# Altium project MSB.PrjPcb
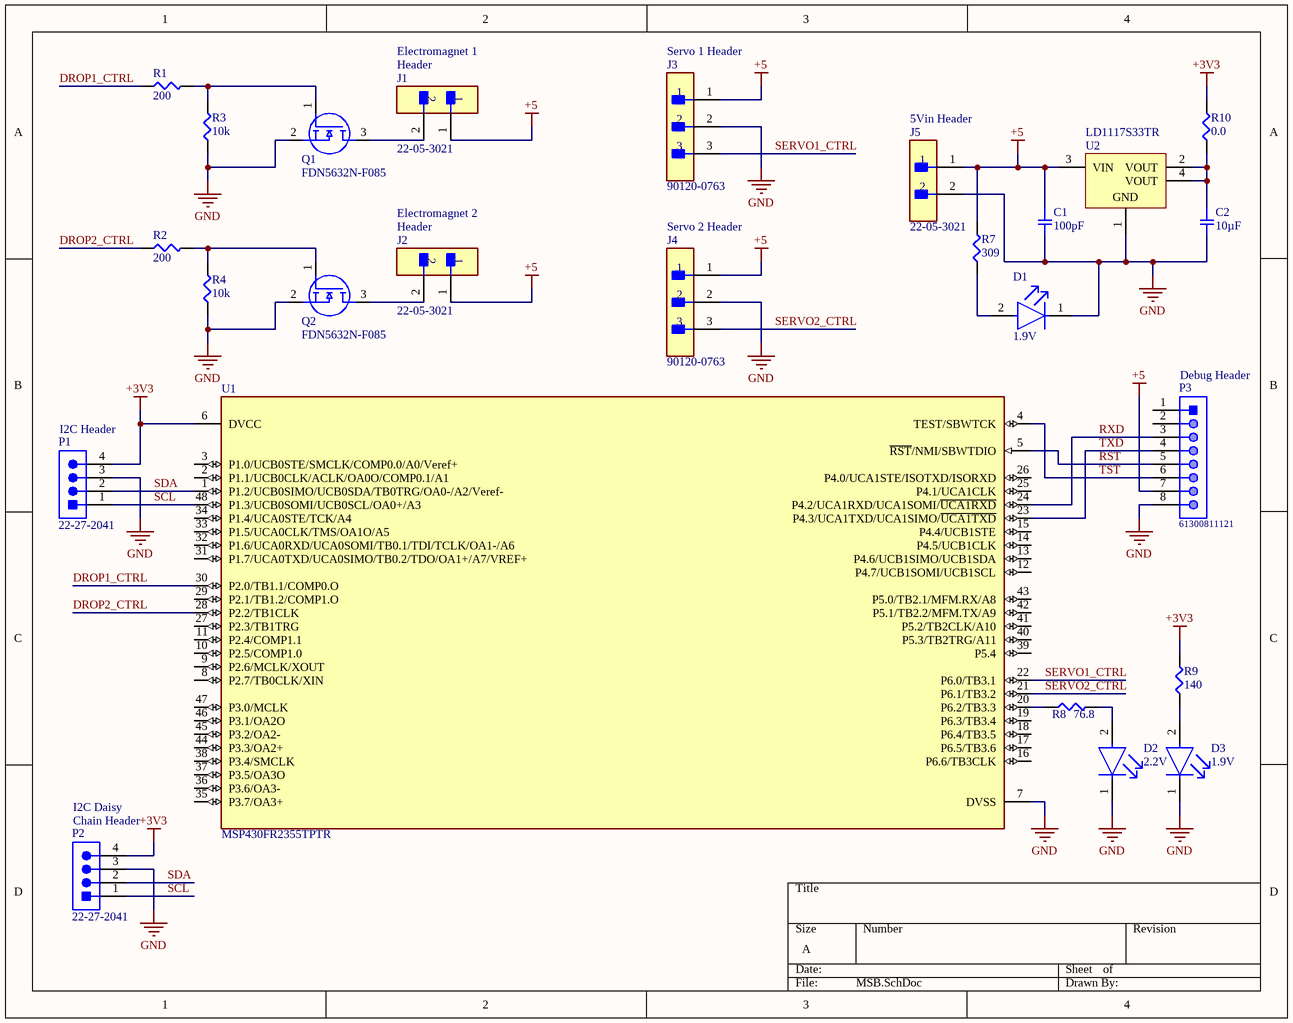
[diagram p0: MSB.SchDoc]
1 sheet, 25 parts. Net scope: global (net labels, ports and power ports of the same name join across sheets).
Board file: MSB.PcbDoc

## Sheet MSB.SchDoc
size A

### Parts
C1  100pF  [SMD-0805C]
C2  10µF  [SMD-0805C]
D1  1.9V  [FP-150080SS75000-MFG]
D2  2.2V  [FP-LTST-C171GKT-MFG]
D3  1.9V  [FP-150080SS75000-MFG]
J1  22-05-3021  [FP-22-05-3021-MFG]
J2  22-05-3021  [FP-22-05-3021-MFG]
J3  90120-0763  [FP-90120-0763-MFG]
J4  90120-0763  [FP-90120-0763-MFG]
J5  22-05-3021  [FP-22-05-3021-MFG]
P1  22-27-2041  [MOLX-22-27-2041_V]
P2  22-27-2041  [MOLX-22-27-2041_V]
P3  61300811121  [61300811121]
Q1  FDN5632N-F085  [SOT95P237X122-3N]
Q2  FDN5632N-F085  [SOT95P237X122-3N]
R1  200  [SMD-0805-RES]
R2  200  [SMD-0805-RES]
R3  10k  [SMD-0805-RES]
R4  10k  [SMD-0805-RES]
R7  309  [SMD-0805-RES]
R8  76.8  [SMD-0805-RES]
R9  140  [SMD-0805-RES]
R10  0.0  [SMD-0805-RES]
U1  MSP430FR2355TPTR  [FP-PT0048A-MFG]
U2  LD1117S33TR  [SOT-223_L]

### Nets
+3V3: P1.4 P2.4 R9.2 R10.2 U1.6(DVCC)
+5: C1.1 J1.1 J2.1 J3.1 J4.1 J5.1 P3.7 R7.2 U2.3(VIN)
GND: C1.2 C2.2 D1.1(C) D2.1(C) D3.1(C) J3.2 J4.2 J5.2 P1.3 P2.3 P3.8 Q1.2(S) Q2.2(S) R3.1 R4.1 U1.7(DVSS) U2.1(GND)
DROP1_CTRL: R1.1 U1.30(P2.0/TB1.1/COMP0.O)
DROP2_CTRL: R2.1 U1.28(P2.2/TB1CLK)
RST: P3.5 U1.5(~{RST}/NMI/SBWTDIO)
RXD: P3.3 U1.24(P4.2/UCA1RXD/UCA1SOMI/~{UCA1RXD})
SCL: P1.1 P2.1 U1.48(P1.3/UCB0SOMI/UCB0SCL/OA0+/A3)
SDA: P1.2 P2.2 U1.1(P1.2/UCB0SIMO/UCB0SDA/TB0TRG/OA0-/A2/Veref-)
SERVO1_CTRL: J3.3 U1.22(P6.0/TB3.1)
SERVO2_CTRL: J4.3 U1.21(P6.1/TB3.2)
TST: P3.6 U1.4(TEST/SBWTCK)
TXD: P3.4 U1.23(P4.3/UCA1TXD/UCA1SIMO/~{UCA1TXD})
NetC2_1: C2.1 R10.1 U2.2(VOUT) U2.4(VOUT)
NetD1_2: D1.2(A) R7.1
NetD2_2: D2.2(A) R8.2
NetD3_2: D3.2(A) R9.1
NetJ1_2: J1.2 Q1.3(D)
NetJ2_2: J2.2 Q2.3(D)
NetQ1_1: Q1.1(G) R1.2 R3.2
NetQ2_1: Q2.1(G) R2.2 R4.2
NetR8_1: R8.1 U1.20(P6.2/TB3.3)

Not connected (* = marked no-connect by the designer): P3 1 2; U1 2(P1.1/UCB0CLK/ACLK/OA0O/COMP0.1/A1) 3(P1.0/UCB0STE/SMCLK/COMP0.0/A0/Veref+) 8(P2.7/TB0CLK/XIN) 9(P2.6/MCLK/XOUT) 10(P2.5/COMP1.0) 11(P2.4/COMP1.1) 12(P4.7/UCB1SOMI/UCB1SCL) 13(P4.6/UCB1SIMO/UCB1SDA) 14(P4.5/UCB1CLK) 15(P4.4/UCB1STE) 16(P6.6/TB3CLK) 17(P6.5/TB3.6) 18(P6.4/TB3.5) 19(P6.3/TB3.4) 25(P4.1/UCA1CLK) 26(P4.0/UCA1STE/ISOTXD/ISORXD) 27(P2.3/TB1TRG) 29(P2.1/TB1.2/COMP1.O) 31(P1.7/UCA0TXD/UCA0SIMO/TB0.2/TDO/OA1+/A7/VREF+) 32(P1.6/UCA0RXD/UCA0SOMI/TB0.1/TDI/TCLK/OA1-/A6) 33(P1.5/UCA0CLK/TMS/OA1O/A5) 34(P1.4/UCA0STE/TCK/A4) 35(P3.7/OA3+) 36(P3.6/OA3-) 37(P3.5/OA3O) 38(P3.4/SMCLK) 39(P5.4) 40(P5.3/TB2TRG/A11) 41(P5.2/TB2CLK/A10) 42(P5.1/TB2.2/MFM.TX/A9) 43(P5.0/TB2.1/MFM.RX/A8) 44(P3.3/OA2+) 45(P3.2/OA2-) 46(P3.1/OA2O) 47(P3.0/MCLK)

### Notes on the sheet
- Header
- Electromagnet 1
- (near J3) Servo 1 Header
- (near J5) 5Vin Header
- Electromagnet 2
- (near J4) Servo 2 Header
- (near P1) I2C Header
- (near P3) Debug Header
- (near P2) Chain Header
- (near P2) I2C Daisy

### Library data of the parts
C1 = GQM2195C1H101JB01D: CAP CER 100PF 50V NP0 0805; Manufacturer: Murata Electronics North America; Unit Price (USD): 1.22; Tolerance: ±5%; Quantity Available: 5437; Packaging: Cut Tape (CT); Value: 100pF; Operating Temperature: -55°C ~ 125°C; Package / Case: 0805 (2012 Metric); Manufacturer Part Number: GQM2195C1H101JB01D; Mount: Surface Mount, MLCC; Datasheet URL: http://www.murata.com/~/media/webrenewal/support/library/catalog/products/capacitor/mlcc/c02e.pdf
C2 = GCJ21BR71A106KE01L: CAP CER 10UF 10V X7R 0805; Manufacturer: Murata Electronics North America; Unit Price (USD): 0.56; Tolerance: ±10%; Quantity Available: 2702; Packaging: Cut Tape (CT); Value: 10µF; Operating Temperature: -55°C ~ 125°C; Package / Case: 0805 (2012 Metric); Manufacturer Part Number: GCJ21BR71A106KE01L; Mount: Surface Mount, MLCC; Datasheet URL: http://www.murata.com/~/media/webrenewal/support/library/catalog/products/capacitor/mlcc/c03e.ashx
D1 D3 = CMP-1426-00010-2: LED RED CLEAR 0805 SMD, 150080SS75000; Manufacturer: Wurth Elektronik; Luminous Intensity: 60mcd; Packaging: Cut Tape; Forward Voltage: 1.9V; Mount: Surface Mount; Color: Red; Value: 1.9V; Manufacturer Part Number: 150080SS75000
D2 = CMP-22017-000007-1: LED GREEN CLEAR CHIP SMD, LTST-C171GKT; Manufacturer: Vishay; Luminous Intensity: 12mcd; Forward Voltage: 2.1V; Value: 2.1V; Mount: Surface Mount; Packaging: Tape and Reel; Color: Green; Manufacturer Part Number: LTST-C171GKT
J1 J2 J5 = CMP-04776-000166-1: CONN HEADER R/A 2POS 2.54MM; Manufacturer: Molex; Color: White; Mount: Through Hole; Packaging: Bulk; Pitch: 2.54mm; Orientation: Right Angle; Manufacturer Part Number: 22-05-3021
J3 J4 = CMP-04776-000084-1: CONN HEADER VERT 3POS 2.54MM; Manufacturer: Molex; Manufacturer Part Number: 90120-0763; Pitch: 2.54mm; Mount: Board-To-Board Connector, C-Grid III 90120 Series, Through Hole, Header, 3, 2.54 mm; Datasheet URL: https://www.molex.com/webdocs/datasheets/pdf/en-us/0901200763_PCB_HEADERS.pdf
P1 P2 = CMP-2000-05243-1: Male Header, Pitch 2.54 mm, 1 x 4 Position, Height 11.7 mm, Tail Length 3.56 mm, RoHS, Bulk; Manufacturer: Molex; Operating temperature: 0degCto+75degC; Datasheet URL: http://www.molex.com/pdm_docs/sd/022272041_sd.pdf; Manufacturer Part Number: 22-27-2041
P3 = CMP-1502-01076-1: THT Vertical Pin Header WR-PHD, Pitch 2.54 mm, Single Row, 8 pins; Manufacturer: Wurth Elektronik; Pitch: 2.54mm; Operating Temperature: -40to105degC; Orientation: Vertical; Packaging: Bag; Datasheet URL: https://katalog.we-online.de/em/datasheet/6130xx11121.pdf; Manufacturer Part Number: 61300811121; Mount: Through Hole
Q1 Q2 = FDN5632N-F085: MOSFET Trans MOS N-Ch 60V 1.7A; Manufacturer: Onsemi; Manufacturer Part Number: FDN5632N-F085; Datasheet URL: https://www.onsemi.com/pub/Collateral/FDN5632N_F085-D.PDF
R1 R2 = ERJ-PB6D2000V: RES SMD 200 OHM 0.5% 1/4W 0805; Manufacturer: Panasonic Electronic Components; Unit Price (USD): 0.04968; Power (Watts): 0.25W, 1/4W; Quantity Available: 10000; Packaging: Cut Tape (CT); Value: 200; Tolerance: ±0.5%; Operating Temperature: -55°C ~ 155°C; Package / Case: 0805 (2012 Metric); Manufacturer Part Number: ERJ-PB6D2000V; Datasheet URL: https://industrial.panasonic.com/cdbs/www-data/pdf/RDA0000/AOA0000C100.pdf
R3 R4 = ERJ-6ENF1002V: RES SMD 10K OHM 1% 1/8W 0805; Manufacturer: Panasonic Electronic Components; Unit Price (USD): 0.00729; Power (Watts): 0.125W, 1/8W; Quantity Available: 3985614; Packaging: Cut Tape (CT); Value: 10k; Tolerance: ±1%; Operating Temperature: -55°C ~ 155°C; Package / Case: 0805 (2012 Metric); Manufacturer Part Number: ERJ-6ENF1002V; Datasheet URL: http://industrial.panasonic.com/www-cgi/jvcr13pz.cgi?E+PZ+3+AOA0002+ERJ6ENF1002V+7+WW
R7 = ERJ-6ENF3090V: RES SMD 309 OHM 1% 1/8W 0805; Manufacturer: Panasonic Electronic Components; Unit Price (USD): 0.00729; Power (Watts): 0.125W, 1/8W; Quantity Available: 54759; Packaging: Cut Tape (CT); Value: 309; Tolerance: ±1%; Operating Temperature: -55°C ~ 155°C; Package / Case: 0805 (2012 Metric); Manufacturer Part Number: ERJ-6ENF3090V; Datasheet URL: http://industrial.panasonic.com/www-cgi/jvcr13pz.cgi?E+PZ+3+AOA0002+ERJ6ENF3090V+7+WW
R8 = ERJ-6ENF76R8V: RES SMD 76.8 OHM 1% 1/8W 0805; Manufacturer: Panasonic Electronic Components; Unit Price (USD): 0.00729; Power (Watts): 0.125W, 1/8W; Quantity Available: 23882; Packaging: Cut Tape (CT); Value: 76.8; Tolerance: ±1%; Operating Temperature: -55°C ~ 155°C; Package / Case: 0805 (2012 Metric); Manufacturer Part Number: ERJ-6ENF76R8V; Datasheet URL: http://industrial.panasonic.com/www-cgi/jvcr13pz.cgi?E+PZ+3+AOA0002+ERJ6ENF76R8V+7+WW
R9 = ERJ-6ENF1400V: RES SMD 140 OHM 1% 1/8W 0805; Manufacturer: Panasonic Electronic Components; Unit Price (USD): 0.00729; Power (Watts): 0.125W, 1/8W; Quantity Available: 50700; Packaging: Cut Tape (CT); Value: 140; Tolerance: ±1%; Operating Temperature: -55°C ~ 155°C; Package / Case: 0805 (2012 Metric); Manufacturer Part Number: ERJ-6ENF1400V; Datasheet URL: http://industrial.panasonic.com/www-cgi/jvcr13pz.cgi?E+PZ+3+AOA0002+ERJ6ENF1400V+7+WW
R10 = ERJ-6GEY0R00V: RES SMD 0.0 OHM JUMPER 1/8W 0805; Manufacturer: Panasonic Electronic Components; Unit Price (USD): 0.00544; Power (Watts): 0.125W, 1/8W; Quantity Available: 1597627; Packaging: Cut Tape (CT); Value: 0.0; Tolerance: Jumper; Operating Temperature: -55°C ~ 155°C; Package / Case: 0805 (2012 Metric); Manufacturer Part Number: ERJ-6GEY0R00V; Datasheet URL: http://industrial.panasonic.com/www-cgi/jvcr13pz.cgi?E+PZ+3+AOA0001+ERJ6GEY0R00V+7+WW
U1 = CMP-04869-000010-1: IC MCU 16BIT 32KB FRAM 48LQFP; Manufacturer: Texas Instruments; Manufacturer Part Number: MSP430FR2355TPTR; Datasheet URL: http://www.ti.com/lit/ds/symlink/msp430fr2355.pdf
U2 = CMP-0244-00310-1: Fixed Low Drop Positive Voltage Regulator, 3.3V, 4-Pin SOT-223, Tape and Reel; Manufacturer: Onsemi; Manufacturer Part Number: LD1117S33TR; Datasheet URL: http://www.st.com/internet/com/TECHNICAL_RESOURCES/TECHNICAL_LITERATURE/DATASHEET/CD00000544.pdf